# Altium schematic sheet 780-00054, rev1, Pg1, SCH, Extender for Short Crate PCB.SchDoc
size B; PageSetup: Record=PageOptions|CenterHorizontal=True|CenterVertical=True|PrintScale=1.09|XCorrection=1.00|YCorrection=1.00|PrintKind=0|BorderSize=5000000|LeftOffset=0|BottomOffset=0|Orientation=2|PaperLength=1000|PaperWidth=1000|Scale=100|PaperSource=7|PrintQuality=-4|MediaType=1|DitherType=10|PaperKind=Tabloid|PrintScaleMode=1
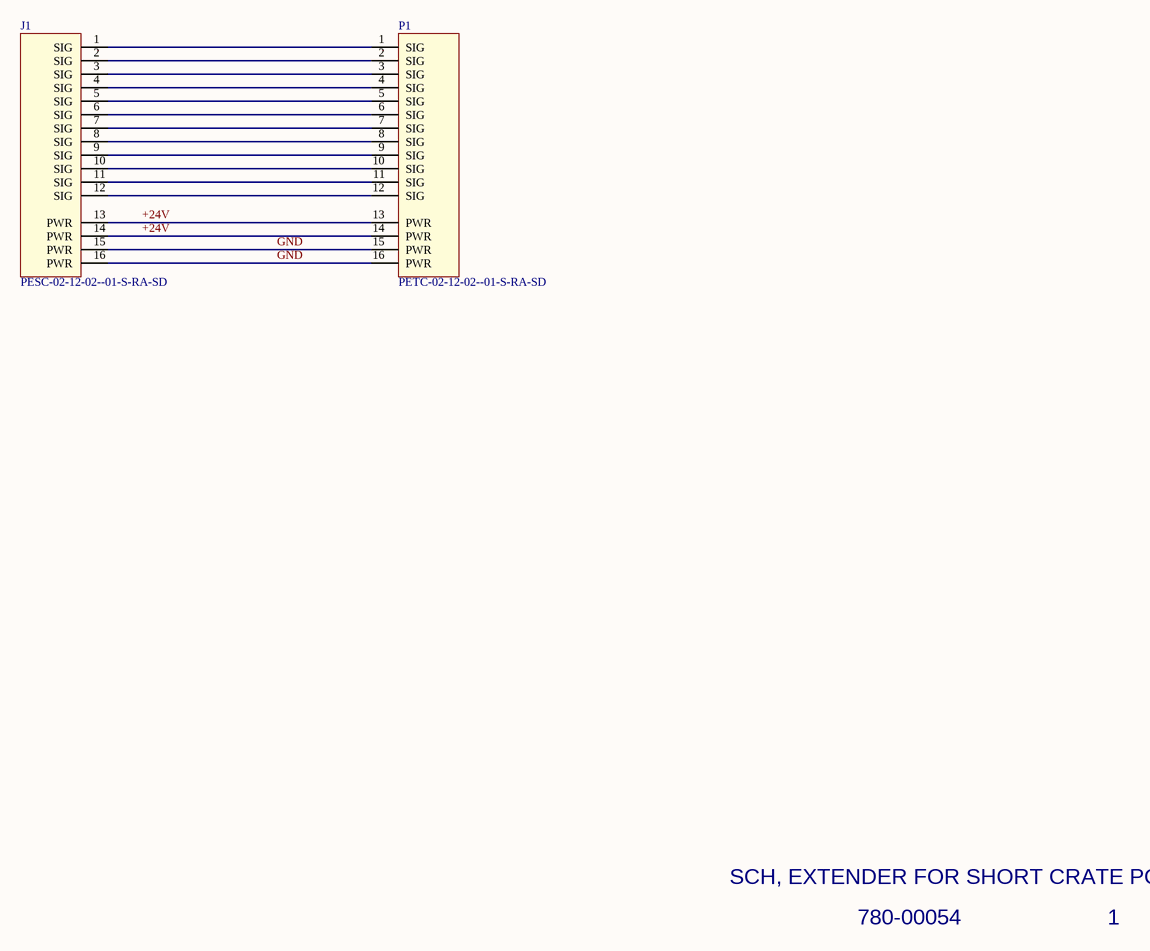
[diagram p0: 780-00054, rev1, Pg1, SCH, Extender for Short Crate PCB.SchDoc]

## Parts
J1  PESC-02-12-02--01-S-RA-SD  [PESC-02-12-02-01-RA]
P1  PETC-02-12-02--01-S-RA-SD  [PETC-02-12-02-01-RA]

## Nets
+24V: J1.13(PWR) J1.14(PWR) P1.13(PWR) P1.14(PWR)
GND: J1.15(PWR) J1.16(PWR) P1.15(PWR) P1.16(PWR)
NetJ1_1: J1.1(SIG) P1.1(SIG)
NetJ1_2: J1.2(SIG) P1.2(SIG)
NetJ1_3: J1.3(SIG) P1.3(SIG)
NetJ1_4: J1.4(SIG) P1.4(SIG)
NetJ1_5: J1.5(SIG) P1.5(SIG)
NetJ1_6: J1.6(SIG) P1.6(SIG)
NetJ1_7: J1.7(SIG) P1.7(SIG)
NetJ1_8: J1.8(SIG) P1.8(SIG)
NetJ1_9: J1.9(SIG) P1.9(SIG)
NetJ1_10: J1.10(SIG) P1.10(SIG)
NetJ1_11: J1.11(SIG) P1.11(SIG)
NetJ1_12: J1.12(SIG) P1.12(SIG)

## Notes on the sheet
- SCH, EXTENDER FOR SHORT CRATE PCB
- 780-00054
- 1

## Library data of the parts
J1 = PETC-02-12-02--01-S-RA-SD: SAMTEC, SIGNAL(12)+PWR(4); LCO p/n: 125-00359; Vendor Mult.: 1; Manufacturer: SAMTEC; Manuf p/n: PESC-02-12-02--01-S-RA-SD; Vendor: SAMTEC; Vendor p/n: PESC-02-12-02--01-S-RA-SD
P1 = PETC-02-12-02--01-S-RA-SD: SAMTEC, SIGNAL(12)+PWR(4); LCO p/n: 125-00087; Vendor Mult.: 1; Manufacturer: SAMTEC; Manuf p/n: PETC-02-12-02--01-S-RA-SD; Vendor: SAMTEC; Vendor p/n: PETC-02-12-02--01-S-RA-SD